# EAGLE design mainboard (EAGLE 8.6.1)
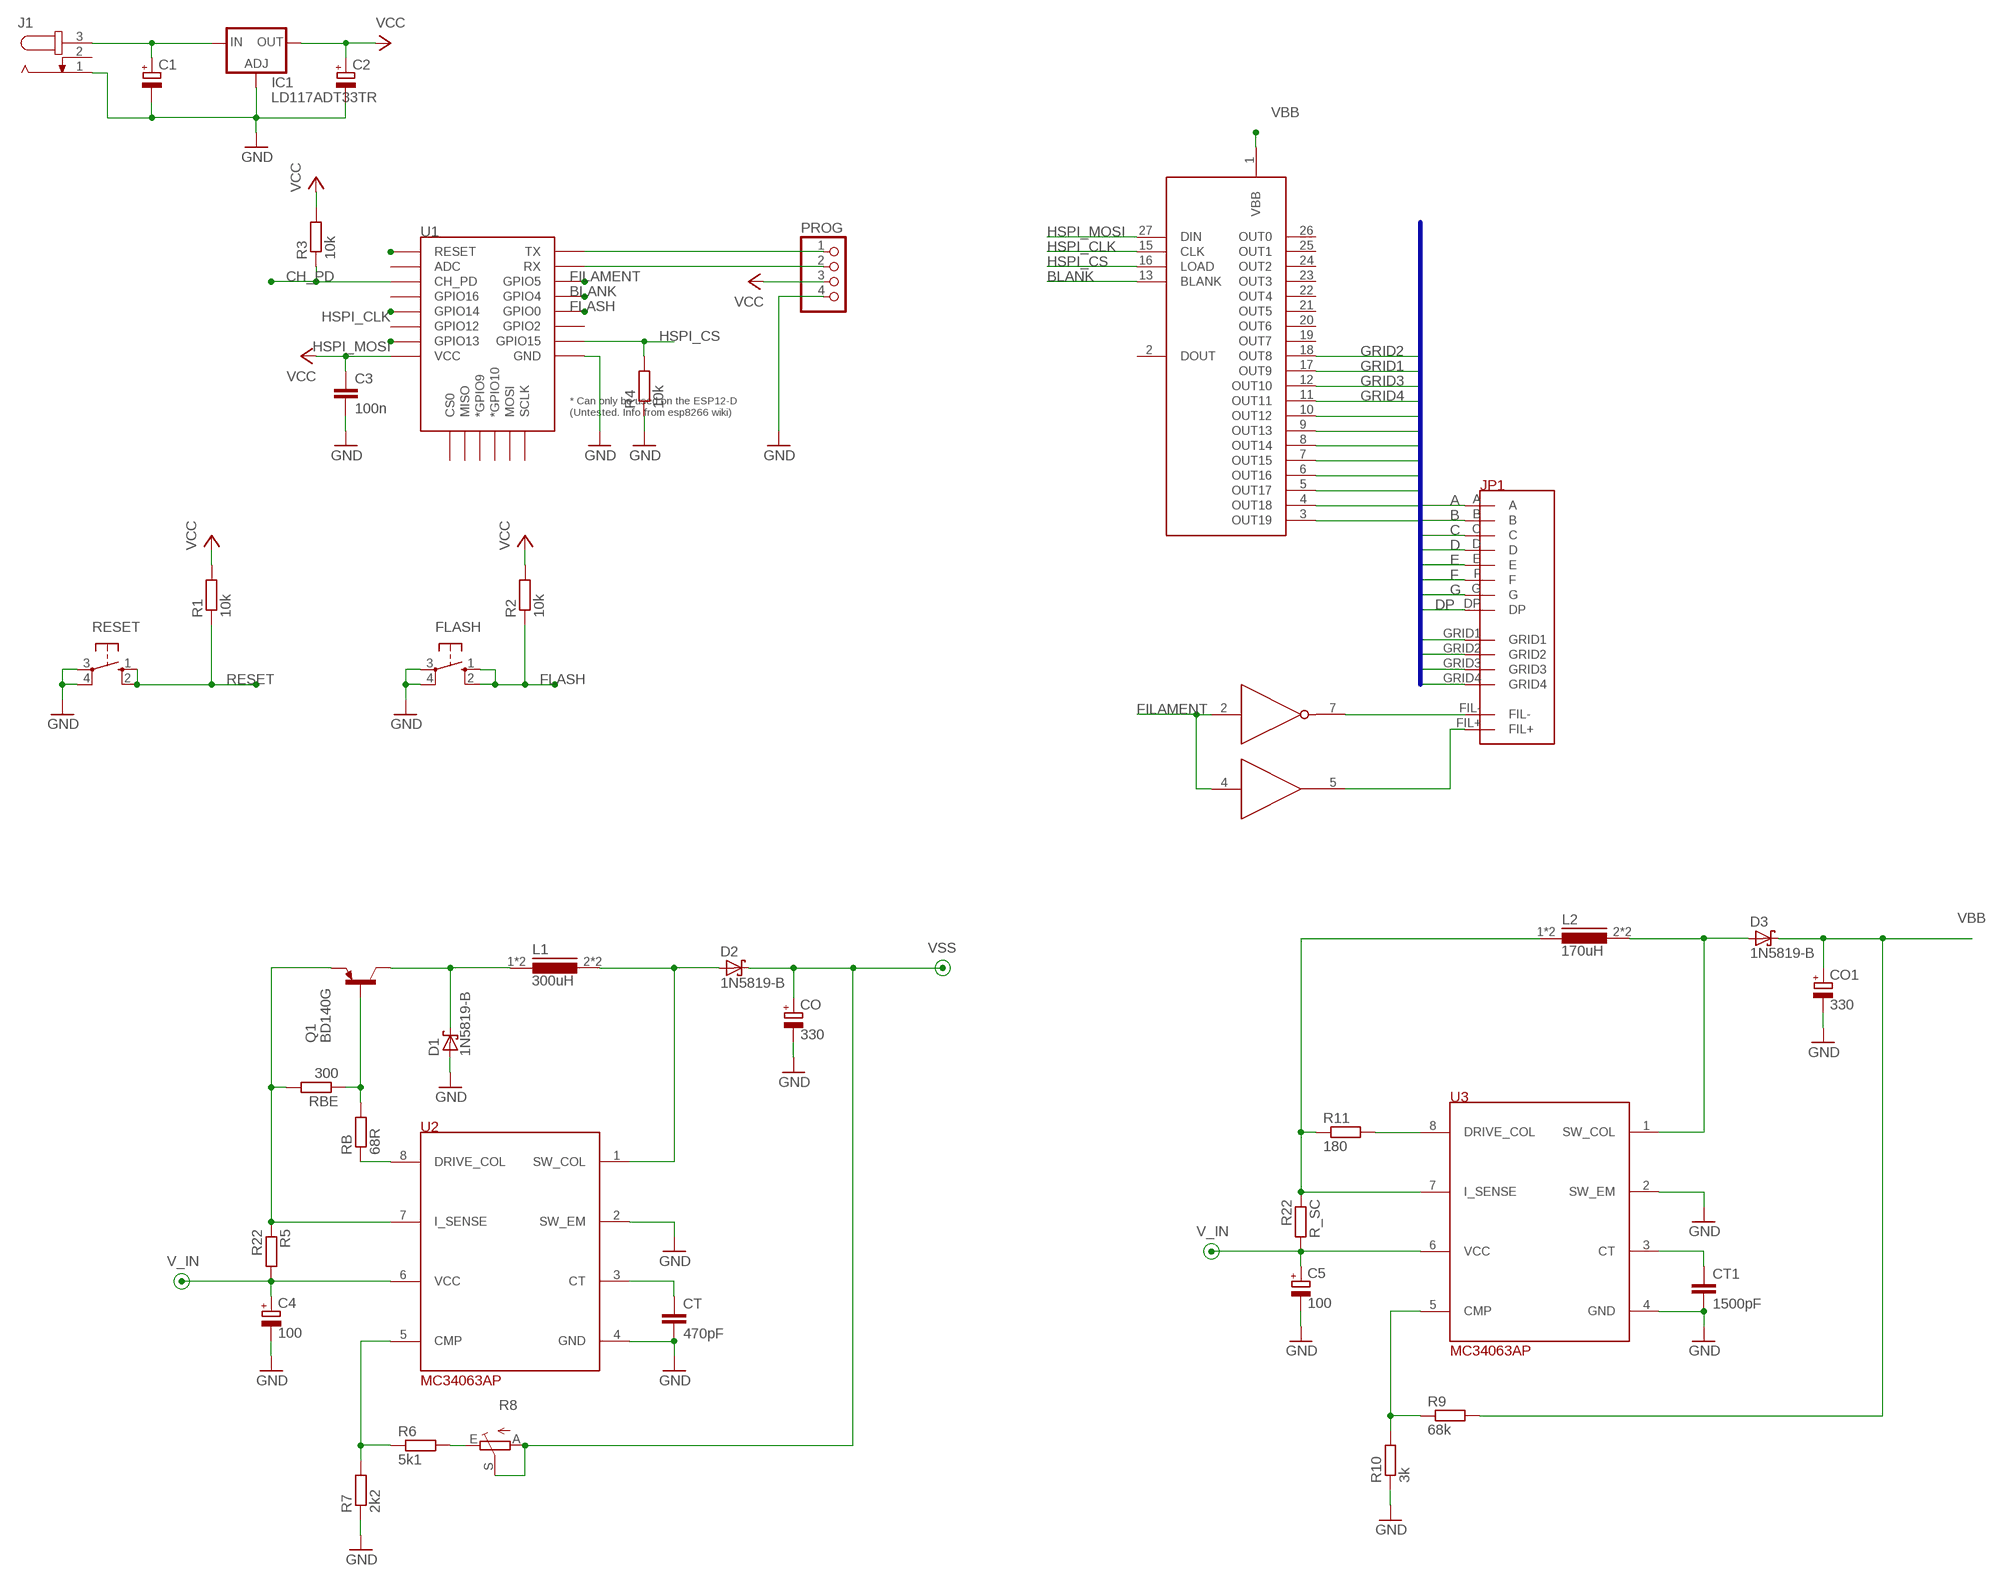
[diagram p0: schematic, sheet 1]

## Parts
C1  CPOL-EUTT2D5L  [TT2D5L]
C2  CPOL-EUTT2D5L  [TT2D5L]
C3  100n  C-EU050-024X044  [C050-024X044]
C4  100  CPOL-EUTT2D5L  [TT2D5L]
C5  100  CPOL-EUTT2D5L  [TT2D5L]
CO  330  CPOL-TT5D11R  [TT5D11R]
CO1  330  CPOL-EUTT5D11L  [TT5D11L]
CT  470pF  C-EU025-025X050  [C025-025X050]
CT1  1500pF  C-EU025-025X050  [C025-025X050]
D1  1N5819-B  [DO41-7.6]
D2  1N5819-B  [DO41-7.6]
D3  1N5819-B  [DO41-7.6]
FLASH  10-XX  [B3F-10XX]
IC1  LD117ADT33TR  [DPACK]
J1  JACK-PLUG0  [SPC4077]
JP1  PINHD-2X102X10-MALE  [2X10]
L1  300uH  INDUCTOR  [TOROID]
L2  170uH  INDUCTOR  [TOROID]
PROG  PINHD-1X4/90  [1X04/90]
Q1  BD140G  [TO225AA]
R1  10k  R-EU_0207/12  [0207/12]
R2  10k  R-EU_0204/7  [0204/7]
R3  10k  R-EU_0207/10  [0207/10]
R4  10k  R-EU_0204/7  [0204/7]
R5  R22  R-EU_0411/15  [0411/15]
R6  5k1  R-EU_0204/7  [0204/7]
R7  2k2  R-EU_0204/7  [0204/7]
R8  TRIM_EU-S64W  [S64W]
R9  68k  R-EU_0204/7  [0204/7]
R10  3k  R-EU_0204/7  [0204/7]
R11  180  R-EU_0204/7  [0204/7]
R_SC  R22  R-EU_0411/15  [0411/15]
RB  68R  R-EU_0204/7  [0204/7]
RBE  300  R-EU_0204/7  [0204/7]
RESET  10-XX  [B3F-10XX]
U1  ESP12ESMD  [ESP12E-SMD]
U2  MC34063AP  [DIL8]
U3  MC34063AP  [DIL8]
U$1  MAX6921AWI  [SOP28X]
U$2  MAX628  [DIL8]

## Nets
A: JP1.A U$1.10(OUT12)
B: JP1.B U$1.9(OUT13)
BLANK: U1.GPIO4 U$1.13(BLANK)
C: JP1.C U$1.8(OUT14)
CH_PD: R3.1 U1.CH_PD
D: JP1.D U$1.7(OUT15)
DP: JP1.DP U$1.3(OUT19)
E: JP1.E U$1.6(OUT16)
F: JP1.F U$1.5(OUT17)
FILAMENT: U1.GPIO5 U$2.2(A:IN) U$2.4(B:IN)
FLASH: FLASH.1(S) FLASH.2(S1) R2.1 U1.GPIO0
G: JP1.G U$1.4(OUT18)
GND: C1.- C2.- C3.2 C4.- C5.- CO1.- CO.- CT1.2 CT.2 D1.A FLASH.3(P) FLASH.4(P1) IC1.1(ADJ) J1.1 PROG.4 R4.1 R7.1 R10.1 RESET.3(P) RESET.4(P1) U1.GND U2.2(SW_EM) U2.4(GND) U3.2(SW_EM) U3.4(GND)
GRID1: JP1.GRID1 U$1.17(OUT9)
GRID2: JP1.GRID2 U$1.18(OUT8)
GRID3: JP1.GRID3 U$1.12(OUT10)
GRID4: JP1.GRID4 U$1.11(OUT11)
HSPI_CLK: U1.GPIO14 U$1.15(CLK)
HSPI_CS: R4.2 U1.GPIO15 U$1.16(LOAD)
HSPI_MOSI: U1.GPIO13 U$1.27(DIN)
N$1: JP1.FIL- U$2.7(A:OUT)
N$2: JP1.FIL+ U$2.5(B:OUT)
N$3: Q1.3(B) RB.2 RBE.1
N$4: RB.1 U2.8(DRIVE_COL)
N$5: Q1.1(E) R5.1 RBE.2 U2.7(I_SENSE)
N$6: D2.A L1.2 L1.2A U2.1(SW_COL)
N$7: D1.C L1.1 L1.1A Q1.2(C)
N$8: CT.1 U2.3(CT)
N$9: R6.1 R7.2 U2.5(CMP)
N$10: R6.2 R8.E
N$11: L2.1 L2.1A R11.1 R_SC.1 U3.7(I_SENSE)
N$12: D3.A L2.2 L2.2A U3.1(SW_COL)
N$13: CT1.1 U3.3(CT)
N$14: R9.1 R10.2 U3.5(CMP)
N$15: R11.2 U3.8(DRIVE_COL)
RESET: R1.1 RESET.1(S) RESET.2(S1) U1.RESET
RX: PROG.2 U1.RXD0(RX)
TX: PROG.1 U1.TXD0(TX)
V_IN: C1.+ C4.+ C5.+ IC1.3(IN) J1.3 R5.2 R_SC.2 U2.6(VCC) U3.6(VCC)
VBB: CO1.+ D3.C R9.2 U$1.1(VBB)
VCC: C2.+ C3.1 IC1.4(OUT) PROG.3 R1.2 R2.2 R3.2 U1.VCC
VSS: CO.+ D2.C R8.A R8.S
Unconnected: J1.2 U1.ADC U1.CS0 U1.GPIO2 U1.GPIO9(*GPIO9) U1.GPIO10(*GPIO10) U1.GPIO12 U1.GPIO16 U1.MISO U1.MOSI U1.SCLK U$1.2(DOUT) U$1.19(OUT7) U$1.20(OUT6) U$1.21(OUT5) U$1.22(OUT4) U$1.23(OUT3) U$1.24(OUT2) U$1.25(OUT1) U$1.26(OUT0)

## Buses
A,B,C,D,E,F,G,DP,GRID[1..4]

## Power pins joined to a net without a drawn wire
GND: U$1.14(GND) U$2.3(GND)
VCC: U$1.28(VCC)
VSS: U$2.6(VSS)

## Library data of the parts
C1 C2 C4 C5 CO1 = rcl:CPOL-EU: POLARIZED CAPACITOR, European symbol; SPICEPREFIX: C
C3 CT CT1 = rcl:C-EU: CAPACITOR, European symbol; SPICEPREFIX: C
CO = russian-vfds:CPOL
D1-D3 = russian-vfds:1N581*: 1.0A SCHOTTKY BARRIER RECTIFIER Source: http://www.diodes.com/datasheets/ds23001.pdf
FLASH RESET = switch-omron:10-XX: OMRON SWITCH; MPN: B3F-1000; OC_FARNELL: 176432; OC_NEWARK: 36M3542
IC1 = v-reg:LD117A?*: Low drop fixed and adjustable positive voltage regulators 1 A Source: http://www.st.com/stonline/products/literature/ds/7194/ld1117axx.pdf
J1 = con-jack:JACK-PLUG: DC POWER JACK Power Jack, DC, Right Angle, Through Hole, Rated 5A at 16VDC, PC Terminals Distributor: Farnell (www.Farnell.de) Drawing: 84N1161.pdf / 84N1162.pdf Manufacturer: SPC Technology (www.spctechnology.com) Type: SPC4077 / SPC 4078; OC_FARNELL: unknown; OC_NEWARK: unknown
JP1 = russian-vfds:PINHD-2X10: PIN HEADER
L1 L2 = russian-vfds:INDUCTOR: INDUCTOR; SPICEPREFIX: L
PROG = pinhead:PINHD-1X4: PIN HEADER
Q1 = russian-vfds:BD140: PNP Transistor
R1-R4 = resistor:R-EU_: RESISTOR, European symbol
R5-R7 R9-R11 R_SC RB RBE = rcl:R-EU_: RESISTOR, European symbol; SPICEPREFIX: R
R8 = pot:TRIM_EU-: POTENTIOMETER
U1 = esp8266modules:ESP12E: ESP12E Module
U2 U3 = russian-vfds:MC34063A
U$1 = russian-vfds:MAX6921
U$2 = russian-vfds:MAX628

## Module 30V_SUPPLY
Ports: 

### Library data of the parts

## Board
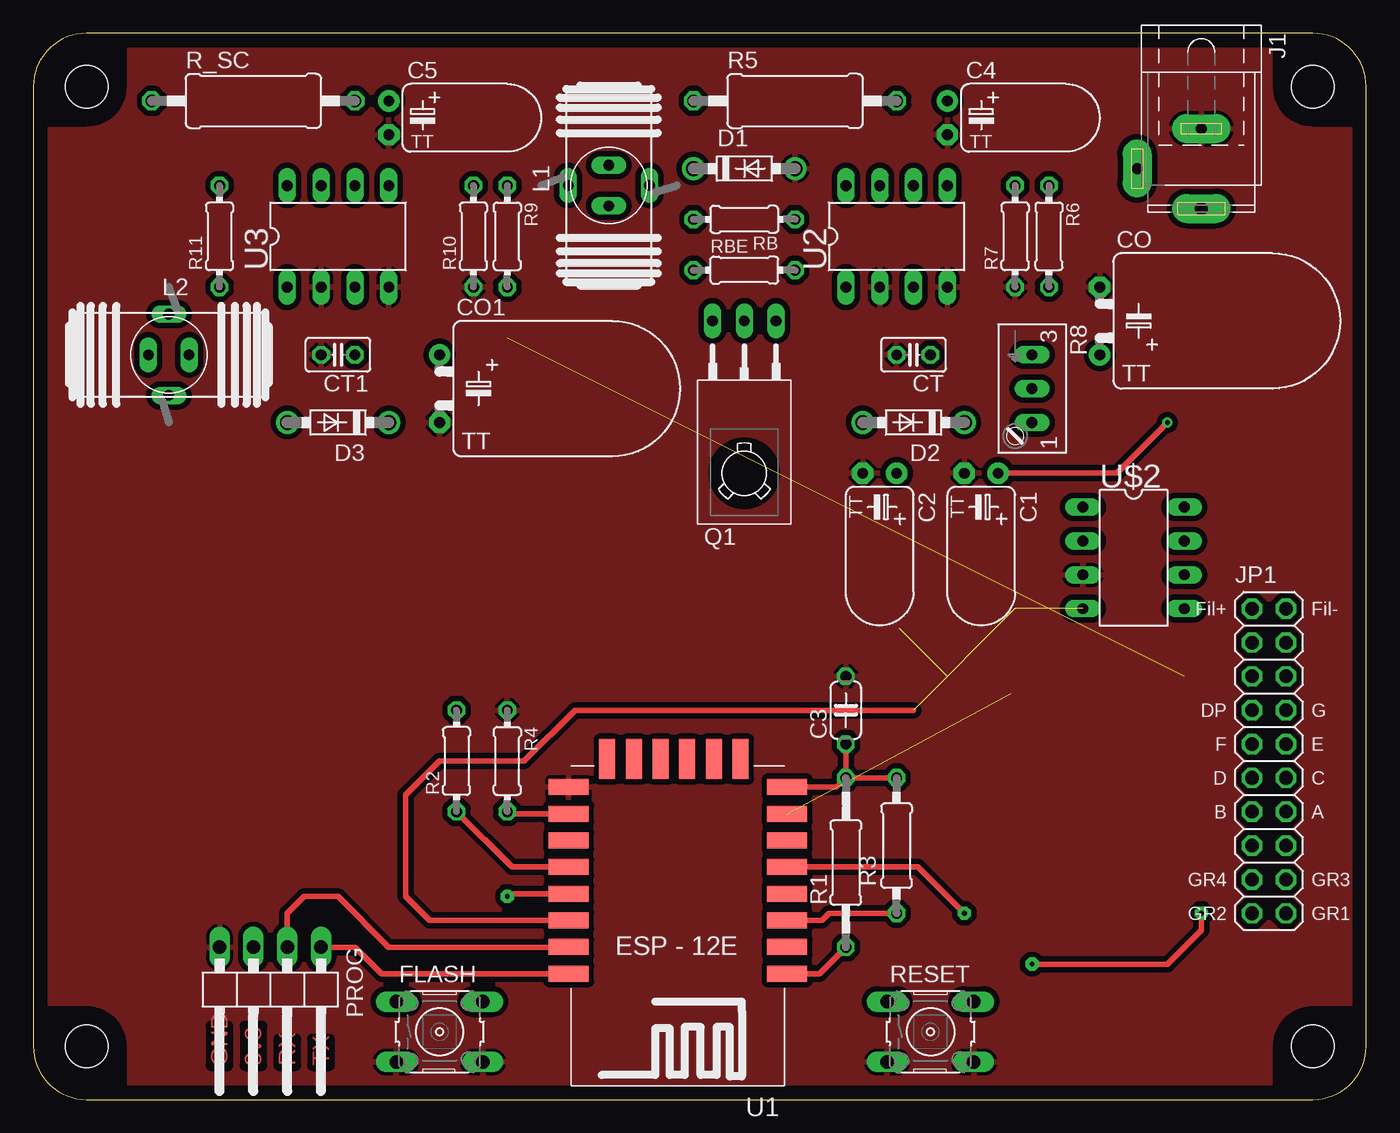
[diagram p1: board, top side]
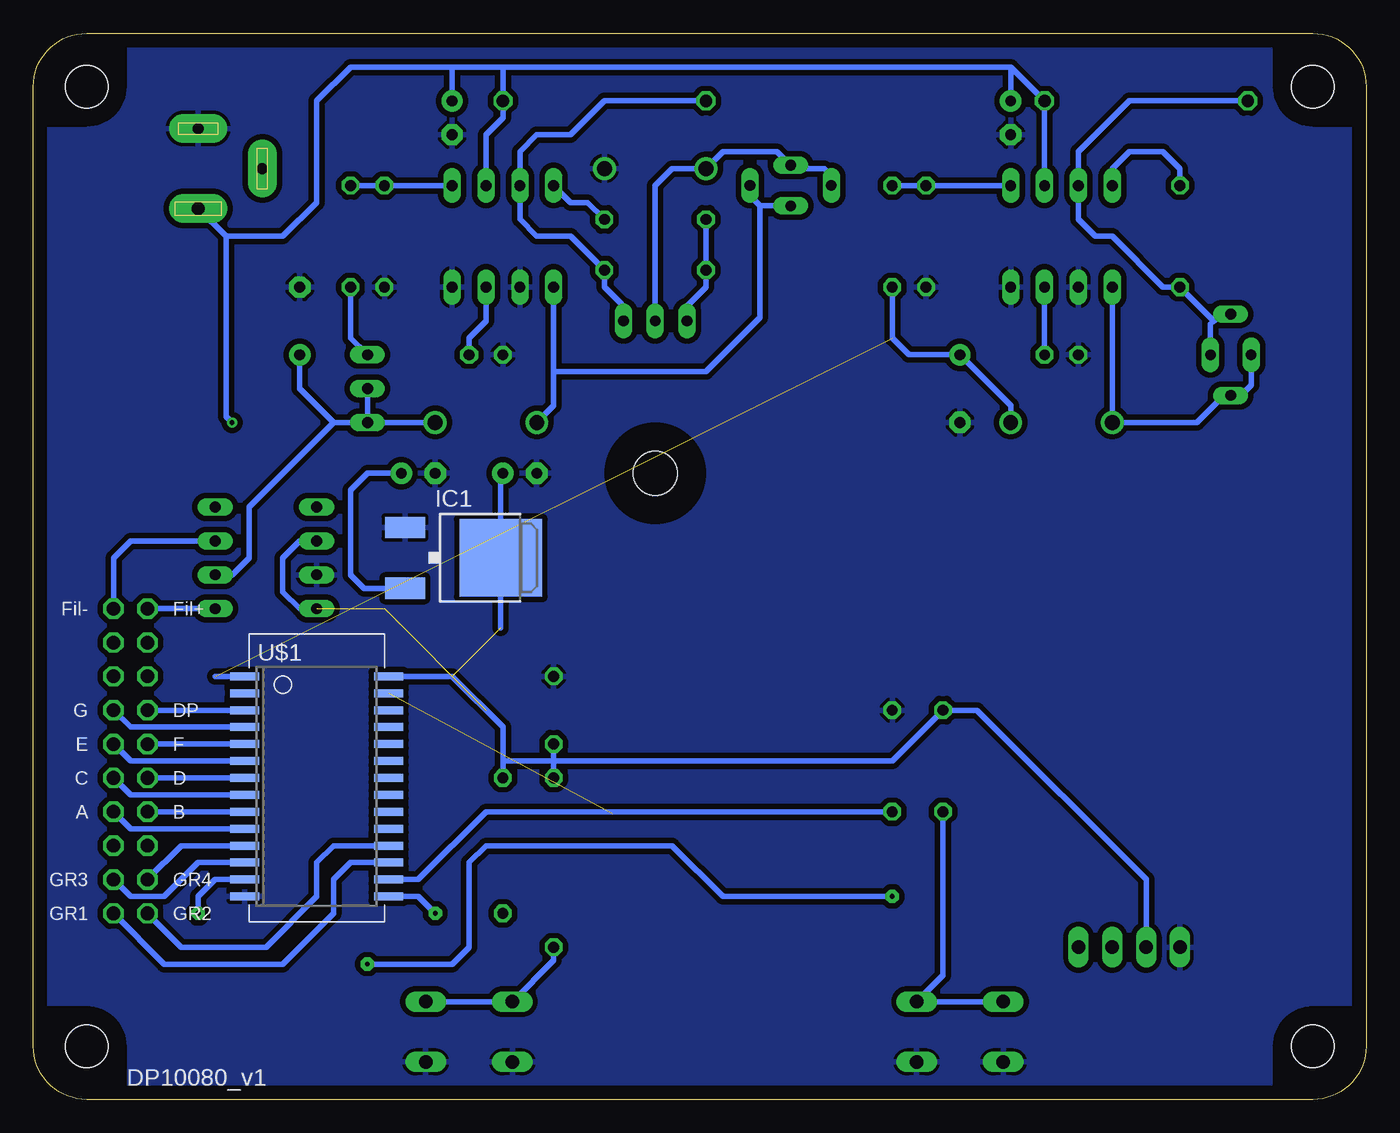
[diagram p2: board, bottom side, seen from below]

Size 100 x 80 mm. Coordinates in mm from the lower left corner, seen from the top.
Copper layers (1*16): Top 0.035mm / dielectric 1.5mm / Bottom 0.035mm
Design rules "default *": minimum track width 6mil, minimum drill 0.35mm, track to track 16mil, track to pad 10mil, pad to pad 16mil, via to via 16mil, smd to smd 6mil, copper to edge 40mil, drill to drill 6mil, minimum pad ring 10mil, minimum via ring 8mil, stop-mask expansion 4mil, vias tented up to drill 0mil, thermal gap 10mil

### Footprints (pad centres in the part's own frame; a part is rotated, then mirrored left to right if it is on the bottom)
TT2D5L = drill 0.813 pad 1.6: + -1.27,0 | drill 0.813 pad 1.6 octagon: - 1.27,0
C050-024X044 = drill 0.813 octagon: 1 -2.54,0; 2 2.54,0
TT5D11R = drill 0.813 pad 1.6: + 2.54,0 | drill 0.813 pad 1.6 octagon: - -2.54,0
TT5D11L = drill 0.813 pad 1.6: + -2.54,0 | drill 0.813 pad 1.6 octagon: - 2.54,0
C025-025X050 = drill 0.813 octagon: 1 -1.27,0; 2 1.27,0
DO41-7.6 = drill 1.1 pad 1.7: A 3.81,0; C -3.81,0
B3F-10XX = drill 1.016 long: 1 -3.251,2.261; 2 3.251,2.261; 3 -3.251,-2.261; 4 3.251,-2.261
DPACK = smd 1.6 x 3: 1 -2.28,-4.8; 3 2.28,-4.8 | smd 5.8 x 6.2: 4 0,2.38
SPC4077 = drill 0.8 pad 2.184 long: 1 -3,0; 2 0,-4.8 | drill 1 pad 2.184 long: 3 3,0
2X10 = drill 1.016 octagon: 5 1.27,-6.35; 6 -1.27,-6.35; 15 1.27,6.35; 16 -1.27,6.35; 17 1.27,8.89; 18 -1.27,8.89; A 1.27,-3.81; B -1.27,-3.81; C 1.27,-1.27; D -1.27,-1.27; DP -1.27,3.81; E 1.27,1.27; F -1.27,1.27; FIL+ -1.27,11.43; FIL- 1.27,11.43; G 1.27,3.81; GRID1 1.27,-11.43; GRID2 -1.27,-11.43; GRID3 1.27,-8.89; GRID4 -1.27,-8.89
TOROID = drill 0.8 long: 1 -3.048,0; 1A 0,1.524; 2 3.048,0; 2A 0,-1.524
1X04/90 = drill 1.016 long: 1 -3.81,-3.81; 2 -1.27,-3.81; 3 1.27,-3.81; 4 3.81,-3.81
TO225AA = drill 0.813 long: 1 -2.381,-11.43; 2 0,-11.43; 3 2.381,-11.43 | hole 3.302: 0,0
0207/12 = drill 0.813 octagon: 1 -6.35,0; 2 6.35,0
0204/7 = drill 0.813 octagon: 1 -3.81,0; 2 3.81,0
0207/10 = drill 0.813 octagon: 1 -5.08,0; 2 5.08,0
0411/15 = drill 0.914 octagon: 1 -7.62,0; 2 7.62,0
S64W = drill 0.813 long: A 2.54,1.27; E -2.54,1.27; S 0,1.27
ESP12E-SMD = smd 3 x 1.2: ADC -8.3,3.8; CH_PD -8.3,1.8; GND 8.1,-8.2; GPIO0 8.1,-2.2; GPIO2 8.1,-4.2; GPIO4 8.1,-0.2; GPIO5 8.1,1.8; GPIO12 -8.3,-4.2; GPIO13 -8.3,-6.2; GPIO14 -8.3,-2.2; GPIO15 8.1,-6.2; GPIO16 -8.3,-0.2; RESET -8.3,5.8; RXD0 8.1,3.8; TXD0 8.1,5.8; VCC -8.3,-8.2 | smd 1.2 x 3: CS0 -4.8,-10.3; GPIO9 -0.8,-10.3; GPIO10 1.2,-10.3; MISO -2.8,-10.3; MOSI 3.2,-10.3; SCLK 5.2,-10.3
DIL8 = drill 0.813 long: 1 -3.81,-3.81; 2 -1.27,-3.81; 3 1.27,-3.81; 4 3.81,-3.81; 5 3.81,3.81; 6 1.27,3.81; 7 -1.27,3.81; 8 -3.81,3.81
SOP28X = smd 0.6 x 2.2: 1 -8.255,-5.4; 2 -6.985,-5.4; 3 -5.715,-5.4; 4 -4.445,-5.4; 5 -3.175,-5.4; 6 -1.905,-5.4; 7 -0.635,-5.4; 8 0.635,-5.4; 9 1.905,-5.4; 10 3.175,-5.4; 11 4.445,-5.4; 12 5.715,-5.4; 13 6.985,-5.4; 14 8.255,-5.4; 15 8.255,5.4; 16 6.985,5.4; 17 5.715,5.4; 18 4.445,5.4; 19 3.175,5.4; 20 1.905,5.4; 21 0.635,5.4; 22 -0.635,5.4; 23 -1.905,5.4; 24 -3.175,5.4; 25 -4.445,5.4; 26 -5.715,5.4; 27 -6.985,5.4; 28 -8.255,5.4
DP10080_V1 = hole 3.2: 4,4; 96,4; 96,76; 4,76

### Placement (x,y rotation side)
C1  71.12,46.99 180 top
C2  63.5,46.99 180 top
C3  60.96,29.21 90 top
C4  68.58,73.66 270 top
C5  26.67,73.66 270 top
CO  80.01,58.42 270 top
CO1  30.48,53.34 270 top
CT  66.04,55.88 180 top
CT1  22.86,55.88 180 top
D1  53.34,69.85 0 top
D2  66.04,50.8 180 top
D3  22.86,50.8 180 top
FLASH  30.48,5.08 0 top
IC1  67.31,40.64 270 bottom
J1  87.63,69.85 270 top
JP1  92.71,25.4 0 top
L1  43.18,68.58 0 top
L2  10.16,55.88 270 top
PROG  17.78,7.62 180 top
Q1  53.34,46.99 180 top
R1  60.96,17.78 90 top
R2  31.75,25.4 90 top
R3  64.77,19.05 90 top
R4  35.56,25.4 270 top
R5  57.15,74.93 0 top
R6  76.2,64.77 270 top
R7  73.66,64.77 90 top
R8  73.66,53.34 270 top
R9  35.56,64.77 270 top
R10  33.02,64.77 90 top
R11  13.97,64.77 90 top
R_SC  16.51,74.93 0 top
RB  53.34,66.04 180 top
RBE  53.34,62.23 0 top
RESET  67.31,5.08 0 top
U1  48.26,15.24 180 top
U2  64.77,64.77 0 top
U3  22.86,64.77 0 top
U$1  78.74,23.5 270 bottom
U$2  82.55,40.64 270 top
U$3  [DP10080_V1]  0,0 0 top

### Tracks (layer width: path | path; a pad name or v marks a point on that pad's centre or on a via)
A
  Bottom 0.406: JP1.A 92.71,20.32 U$1.10
B
  Bottom 0.406: JP1.B U$1.9
BLANK  (via drill 0.35 pad 1)
  Top 0.406: v87.63,13.97 87.63,12.7 85.09,10.16 v74.93,10.16 | U1.GPIO4 35.76,15.44 v35.56,15.24
  Bottom 0.406: U$1.13 86.36,16.51 87.63,15.24 v87.63,13.97 | v35.56,15.24 48.26,15.24 52.07,19.05 66.04,19.05 67.31,17.78 67.31,11.43 68.58,10.16 v74.93,10.16
C
  Bottom 0.406: JP1.C 92.71,22.86 U$1.8
CH_PD
  Top 0.406: U1.CH_PD 59.16,13.44 59.69,13.97 R3.1
D
  Bottom 0.406: U$1.7 JP1.D
DP
  Bottom 0.406: U$1.3 JP1.DP
E
  Bottom 0.406: JP1.E 92.71,25.4 U$1.6
F
  Bottom 0.406: U$1.5 JP1.F
FILAMENT  (2 unrouted)
  Top 0.406: 66.04,29.21 40.64,29.21 36.83,25.4 30.48,25.4 27.94,22.86 27.94,15.24 29.74,13.44 U1.GPIO5
  Bottom 0.406: U$2.4 80.01,36.83 81.28,38.1 81.28,40.64 80.01,41.91 U$2.2
FLASH
  Top 0.406: U1.GPIO0 35.9,17.44 R2.1
  Bottom 0.406: R2.1 31.75,9.32 FLASH.2 FLASH.1
G
  Bottom 0.406: JP1.G 92.71,27.94 U$1.4
GND
  pour Bottom: 3.81,78.74 96.52,78.74 99.06,76.2 99.06,3.81 96.52,1.27 3.81,1.27 2.54,1.27 1.27,2.54 1.27,76.2
  pour Top: 3.81,78.74 96.52,78.74 97.79,77.47 99.06,76.2 99.06,2.54 97.79,1.27 2.54,1.27 1.27,2.54 1.27,77.47 2.54,77.47
GRID1
  Bottom 0.406: U$1.17 76.2,17.78 77.47,16.51 77.47,13.97 81.28,10.16 90.17,10.16 JP1.GRID1
GRID2
  Bottom 0.406: JP1.GRID2 88.9,11.43 82.55,11.43 78.74,15.24 78.74,17.78 77.47,19.05 U$1.18
GRID3
  Bottom 0.406: U$1.12 87.63,17.78 90.17,15.24 92.71,15.24 JP1.GRID3
GRID4
  Bottom 0.406: U$1.11 88.9,19.05 JP1.GRID4
HSPI_CLK  (via drill 0.35 pad 1)
  Top 0.406: U1.GPIO14 62.23,17.44 62.57,17.44 66.38,17.44 v69.85,13.97
  Bottom 0.406: U$1.15 71.12,15.24 v69.85,13.97
HSPI_CS
  Top 0.406: U1.GPIO15 35.71,21.44 R4.2
  Bottom 0.406: U$1.16 71.12,16.51 66.04,21.59 R4.2
HSPI_MOSI  (1 unrouted)
N$1
  Bottom 0.406: JP1.FIL- 93.98,40.64 92.71,41.91 U$2.7
N$2
  Bottom 0.406: U$2.5 JP1.FIL+
N$3
  Bottom 0.406: Q1.3 50.96,59.53 49.53,60.96 RBE.1 RB.2
N$4
  Bottom 0.406: RB.1 58.42,67.31 59.69,67.31 U2.8
N$5
  Bottom 0.406: Q1.1 55.88,58.58 55.88,59.69 57.15,60.96 RBE.2 59.69,64.77 62.23,64.77 63.5,66.04 U2.7 63.5,71.12 62.23,72.39 59.69,72.39 57.15,74.93 R5.1
N$6
  Bottom 0.406: U2.1 60.96,54.61 | 60.96,54.61 60.96,52.07 D2.A | L1.2 46.23,67.82 45.47,67.06 | 45.47,67.06 L1.2A | 60.96,54.61 49.53,54.61 45.47,58.67 45.47,67.06
N$7
  Bottom 0.406: Q1.2 53.34,68.58 52.07,69.85 D1.C 48.26,71.12 44.2,71.12 L1.1A 42.16,70.1 41.91,69.85 40.64,69.85 40.13,69.34 L1.1
N$8
  Bottom 0.406: U2.3 66.04,58.42 67.31,57.15 CT.1
N$9
  Bottom 0.406: R6.1 R7.2 U2.5
N$10
  Bottom 0.406: R6.2 76.2,57.15 R8.E
N$11
  Bottom 0.406: L2.1 10.92,58.93 11.43,58.42 | L2.1A 11.68,58.17 11.43,58.42 | 11.43,58.42 R11.1 15.24,60.96 19.05,64.77 20.32,64.77 21.59,66.04 U3.7 21.59,71.12 17.78,74.93 R_SC.1
N$12
  Bottom 0.406: L2.2A 8.64,53.59 9.4,52.83 L2.2 10.67,52.83 12.7,50.8 D3.A U3.1
N$13
  Bottom 0.406: CT1.1 U3.3
N$14
  Bottom 0.406: U3.5 R10.2 R9.1
N$15
  Bottom 0.406: U3.8 19.05,69.85 17.78,71.12 15.24,71.12 13.97,69.85 R11.2
RESET
  Top 0.406: U1.RESET 58.97,9.44 R1.1
  Bottom 0.406: RESET.2 RESET.1 60.96,10.44 R1.1
RX
  Top 0.406: U1.RXD0 26.67,11.43 22.86,15.24 20.32,15.24 19.05,13.97 PROG.2
TX
  Top 0.406: U1.TXD0 26.12,9.44 24.13,11.43 PROG.1
V_IN  (via drill 0.35)
  Top 0.406: v85.09,50.8 81.28,46.99 C1.+
  Bottom 0.406: J1.3 85.55,64.77 | 68.58,77.47 76.2,77.47 78.74,74.93 78.74,67.31 81.28,64.77 85.55,64.77 | 68.58,77.47 64.77,77.47 | U2.6 66.04,72.39 64.77,73.66 R5.2 64.77,77.47 | C4.+ 68.58,77.47 | 64.77,77.47 26.67,77.47 | C5.+ 26.67,77.47 | U3.6 R_SC.2 26.67,77.47 | IC1.3 75.19,38.36 76.2,39.37 76.2,45.72 74.93,46.99 C1.+ | 85.55,64.77 85.55,51.26 v85.09,50.8
VBB  (1 unrouted)
  Bottom 0.406: D3.C 26.67,52.07 CO1.+ 34.29,55.88 35.56,57.15 R9.2 | U$1.1 86.36,31.75
VCC  (1 unrouted)
  Top 0.406: U1.VCC 60.27,23.44 R1.2 | R1.2 C3.1 | R3.2 R1.2
  Bottom 0.406: C3.1 60.96,25.4 | 60.96,25.4 R1.2 | 60.96,25.4 35.56,25.4 R2.2 29.21,29.21 16.51,16.51 PROG.3 | 60.96,25.4 64.77,25.4 | 64.77,25.4 R3.2 | 64.77,25.4 64.77,27.94 68.58,31.75 U$1.28 | C2.+ 64.93,46.83 IC1.4 64.93,35.4
VSS
  Bottom 0.406: R8.A D2.C | R8.A R8.S | U$2.6 85.09,39.37 83.82,40.64 83.82,44.45 77.47,50.8 | 77.47,50.8 R8.A | CO.+ 80.01,53.34 77.47,50.8

### Text on the board
Top: GND | 3v3 | RX | TX